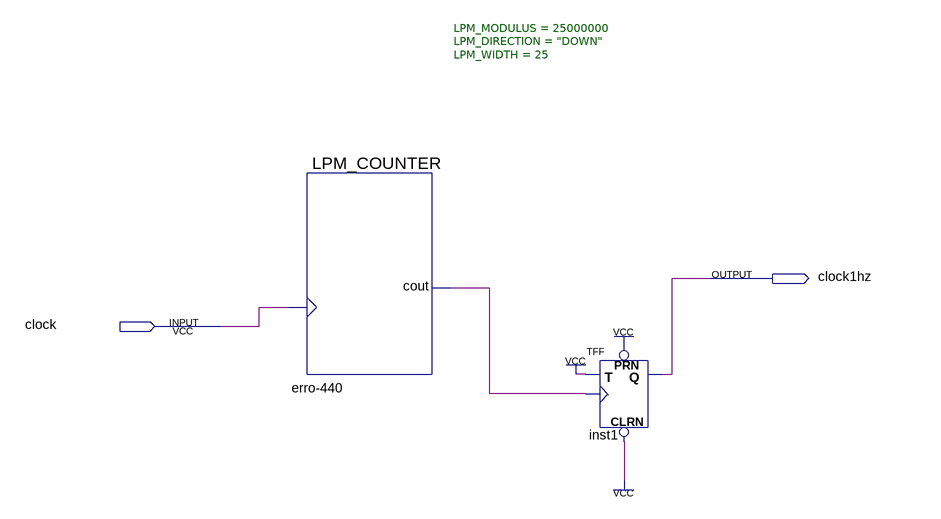
[diagram p0: schematic sheet]
// Quartus schematic divisorClock1hz.bdf as structural Verilog: 2 symbols, 2 pins
module divisorClock1hz (
  input  clock,
  output clock1hz
);

  wire erro_440_cout;

  LPM_COUNTER #(.LPM_MODULUS(25000000), .LPM_DIRECTION("DOWN"), .LPM_WIDTH(25)) \erro-440  (
    .clock(clock), .cout(erro_440_cout));
  TFF inst1 (.PRN(1'b1), .CLRN(1'b1), .T(1'b1), .CLK(erro_440_cout), .Q(clock1hz));
endmodule
